# EAGLE schematic Encoder (EAGLE 6.4)
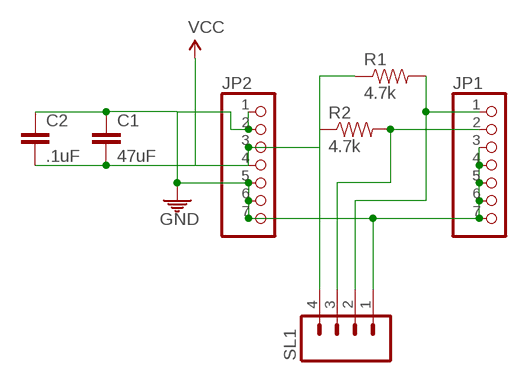
[diagram p0: schematic, sheet 1]

## Parts
C1  47uF  CAP0805  [0805]
C2  .1uF  CAP0805  [0805]
JP1  PINHD-1X7  [1X07]
JP2  PINHD-1X7  [1X07]
R1  4.7k  RESISTOR0805-RES  [0805]
R2  4.7k  RESISTOR0805-RES  [0805]
SL1  M04LOCK  [1X04_LOCK]

## Nets
GND: C1.1 C2.1 JP1.3 JP1.4 JP1.5 JP1.6 JP1.7 JP2.1 JP2.2 JP2.5 JP2.6 JP2.7 SL1.1
N$1: JP1.1 R1.2 SL1.2
N$2: JP1.2 R2.2 SL1.3
VCC: C1.2 C2.2 JP2.3 JP2.4 R1.1 R2.1 SL1.4

## Library data of the parts
C1 C2 = ASL:CAP: Capacitor Standard 0603 ceramic capacitor, and 0.1" leaded capacitor.
JP1 JP2 = baro:PINHD-1X7: PIN HEADER
R1 R2 = ASL:RESISTOR: Resistor Basic schematic elements and footprints for 0603, 1206, and PTH resistors.
SL1 = ASL:M04: AMP QUICK CONNECTOR